# Altium schematic sheet ct_fpga_pwr.SchDoc: FPGA Power Connections
size Letter; SheetNumber: 3; SheetTotal: 8; SheetApproved: YES
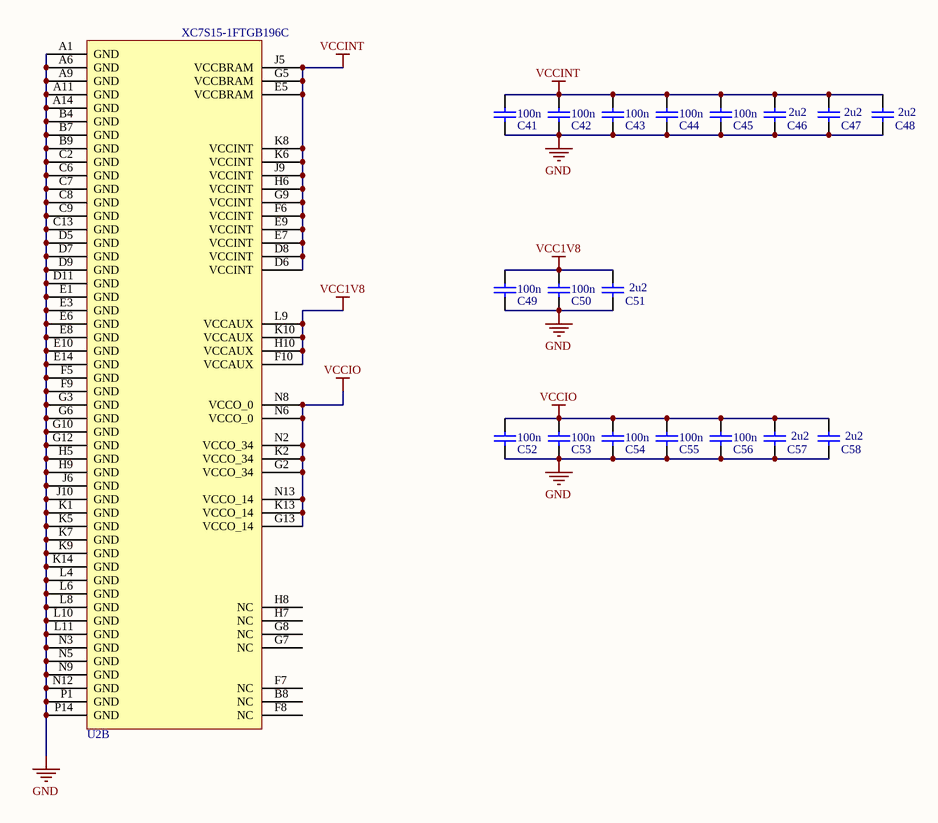
[diagram p0: ct_fpga_pwr.SchDoc]

## Parts
C41  100n  [CAPC0402_M]
C42  100n  [CAPC0402_M]
C43  100n  [CAPC0402_M]
C44  100n  [CAPC0402_M]
C45  100n  [CAPC0402_M]
C46  2u2  [CAPC0603_M]
C47  2u2  [CAPC0603_M]
C48  2u2  [CAPC0603_M]
C49  100n  [CAPC0402_M]
C50  100n  [CAPC0402_M]
C51  2u2  [CAPC0603_M]
C52  100n  [CAPC0402_M]
C53  100n  [CAPC0402_M]
C54  100n  [CAPC0402_M]
C55  100n  [CAPC0402_M]
C56  100n  [CAPC0402_M]
C57  2u2  [CAPC0603_M]
C58  2u2  [CAPC0603_M]
U2  XC7S15-1FTGB196C  [BGA_FTGB196]  (part B of 4)

## Nets
GND: C41.2 C42.2 C43.2 C44.2 C45.2 C46.2 C47.2 C48.2 C49.2 C50.2 C51.2 C52.2 C53.2 C54.2 C55.2 C56.2 C57.2 C58.2 U2.A1(GND) U2.A6(GND) U2.A9(GND) U2.A11(GND) U2.A14(GND) U2.B4(GND) U2.B7(GND) U2.B9(GND) U2.C2(GND) U2.C6(GND) U2.C7(GND) U2.C8(GND) U2.C9(GND) U2.C13(GND) U2.D5(GND) U2.D7(GND) U2.D9(GND) U2.D11(GND) U2.E1(GND) U2.E3(GND) U2.E6(GND) U2.E8(GND) U2.E10(GND) U2.E14(GND) U2.F5(GND) U2.F9(GND) U2.G3(GND) U2.G6(GND) U2.G10(GND) U2.G12(GND) U2.H5(GND) U2.H9(GND) U2.J6(GND) U2.J10(GND) U2.K1(GND) U2.K5(GND) U2.K7(GND) U2.K9(GND) U2.K14(GND) U2.L4(GND) U2.L6(GND) U2.L8(GND) U2.L10(GND) U2.L11(GND) U2.N3(GND) U2.N5(GND) U2.N9(GND) U2.N12(GND) U2.P1(GND) U2.P14(GND)
VCC1V8: C49.1 C50.1 C51.1 U2.F10(VCCAUX) U2.H10(VCCAUX) U2.K10(VCCAUX) U2.L9(VCCAUX)
VCCINT: C41.1 C42.1 C43.1 C44.1 C45.1 C46.1 C47.1 C48.1 U2.D6(VCCINT) U2.D8(VCCINT) U2.E5(VCCBRAM) U2.E7(VCCINT) U2.E9(VCCINT) U2.F6(VCCINT) U2.G5(VCCBRAM) U2.G9(VCCINT) U2.H6(VCCINT) U2.J5(VCCBRAM) U2.J9(VCCINT) U2.K6(VCCINT) U2.K8(VCCINT)
VCCIO: C52.1 C53.1 C54.1 C55.1 C56.1 C57.1 C58.1 U2.G2(VCCO_34) U2.G13(VCCO_14) U2.K2(VCCO_34) U2.K13(VCCO_14) U2.N2(VCCO_34) U2.N6(VCCO_0) U2.N8(VCCO_0) U2.N13(VCCO_14)

Not connected (* = marked no-connect by the designer): U2 B8(NC) F7(NC) F8(NC) G7(NC) G8(NC) H7(NC) H8(NC)

## Notes on the sheet
- Title:
- Date:
- Rev:
- Time:
- Project:
- Sheet
- of
- License:
- Copyright © NewAE Technology Inc.
- Approved:
- NewAE.com
- File:

## Library data of the parts
C41-C45 C49 C50 C52-C56 = CCHIP-100n-0402: 100n, 0402; Component Group: Capacitor; Case-EIA: 0402; Part Number: CCHIP-100n-0402; Footprint: 0402; Pin Count: 2; Value: 100n; Mounting Technology: SMT; Component Kind: Standard; Component Type: Standard
C46-C48 C51 C57 C58 = CCHIP-2u2-0603: 2u2, 0603; Manufacture 1: Samsung; Manufacture Part Number 1: CL10B225KP8NNNC; Component Group: Capacitor; Case-EIA: 0603; Case-Metric: 1608; Rated Voltage: 10VDC; Part Number: CCHIP-2u2-0603; Footprint: 0603; Pin Count: 2; Supplier 1: Digi-Key; Supplier Part Number 1: 1276-1134-2-ND; Value: 2u2; Mounting Technology: SMT; Component Kind: Standard; Component Type: Standard
U2 = XC7S15-1FTGB196C: Xilinx Spartan 7 FPGA, 196FTGB; Component Group: Digital IC; PP Material Stack: 0; Part Number: XC7S15-1FTGB196C; Manufacture 1: Xilinx; Manufacture Part Number 1: XC7S15-1FTGB196C; Pin Count: 196; Supplier 1: Digi-Key; Supplier Part Number 1: 122-2226-ND; Mounting Technology: SMT; Component Kind: Standard; Component Type: Standard; PP Rotation: 0